# Altium schematic sheet Display_port.SchDoc
size B; Organization: Altium Limited; Address1: L3, 12a Rodborough Rd; Address2: Frenchs Forest; Address3: NSW; Address4: Australia 2086
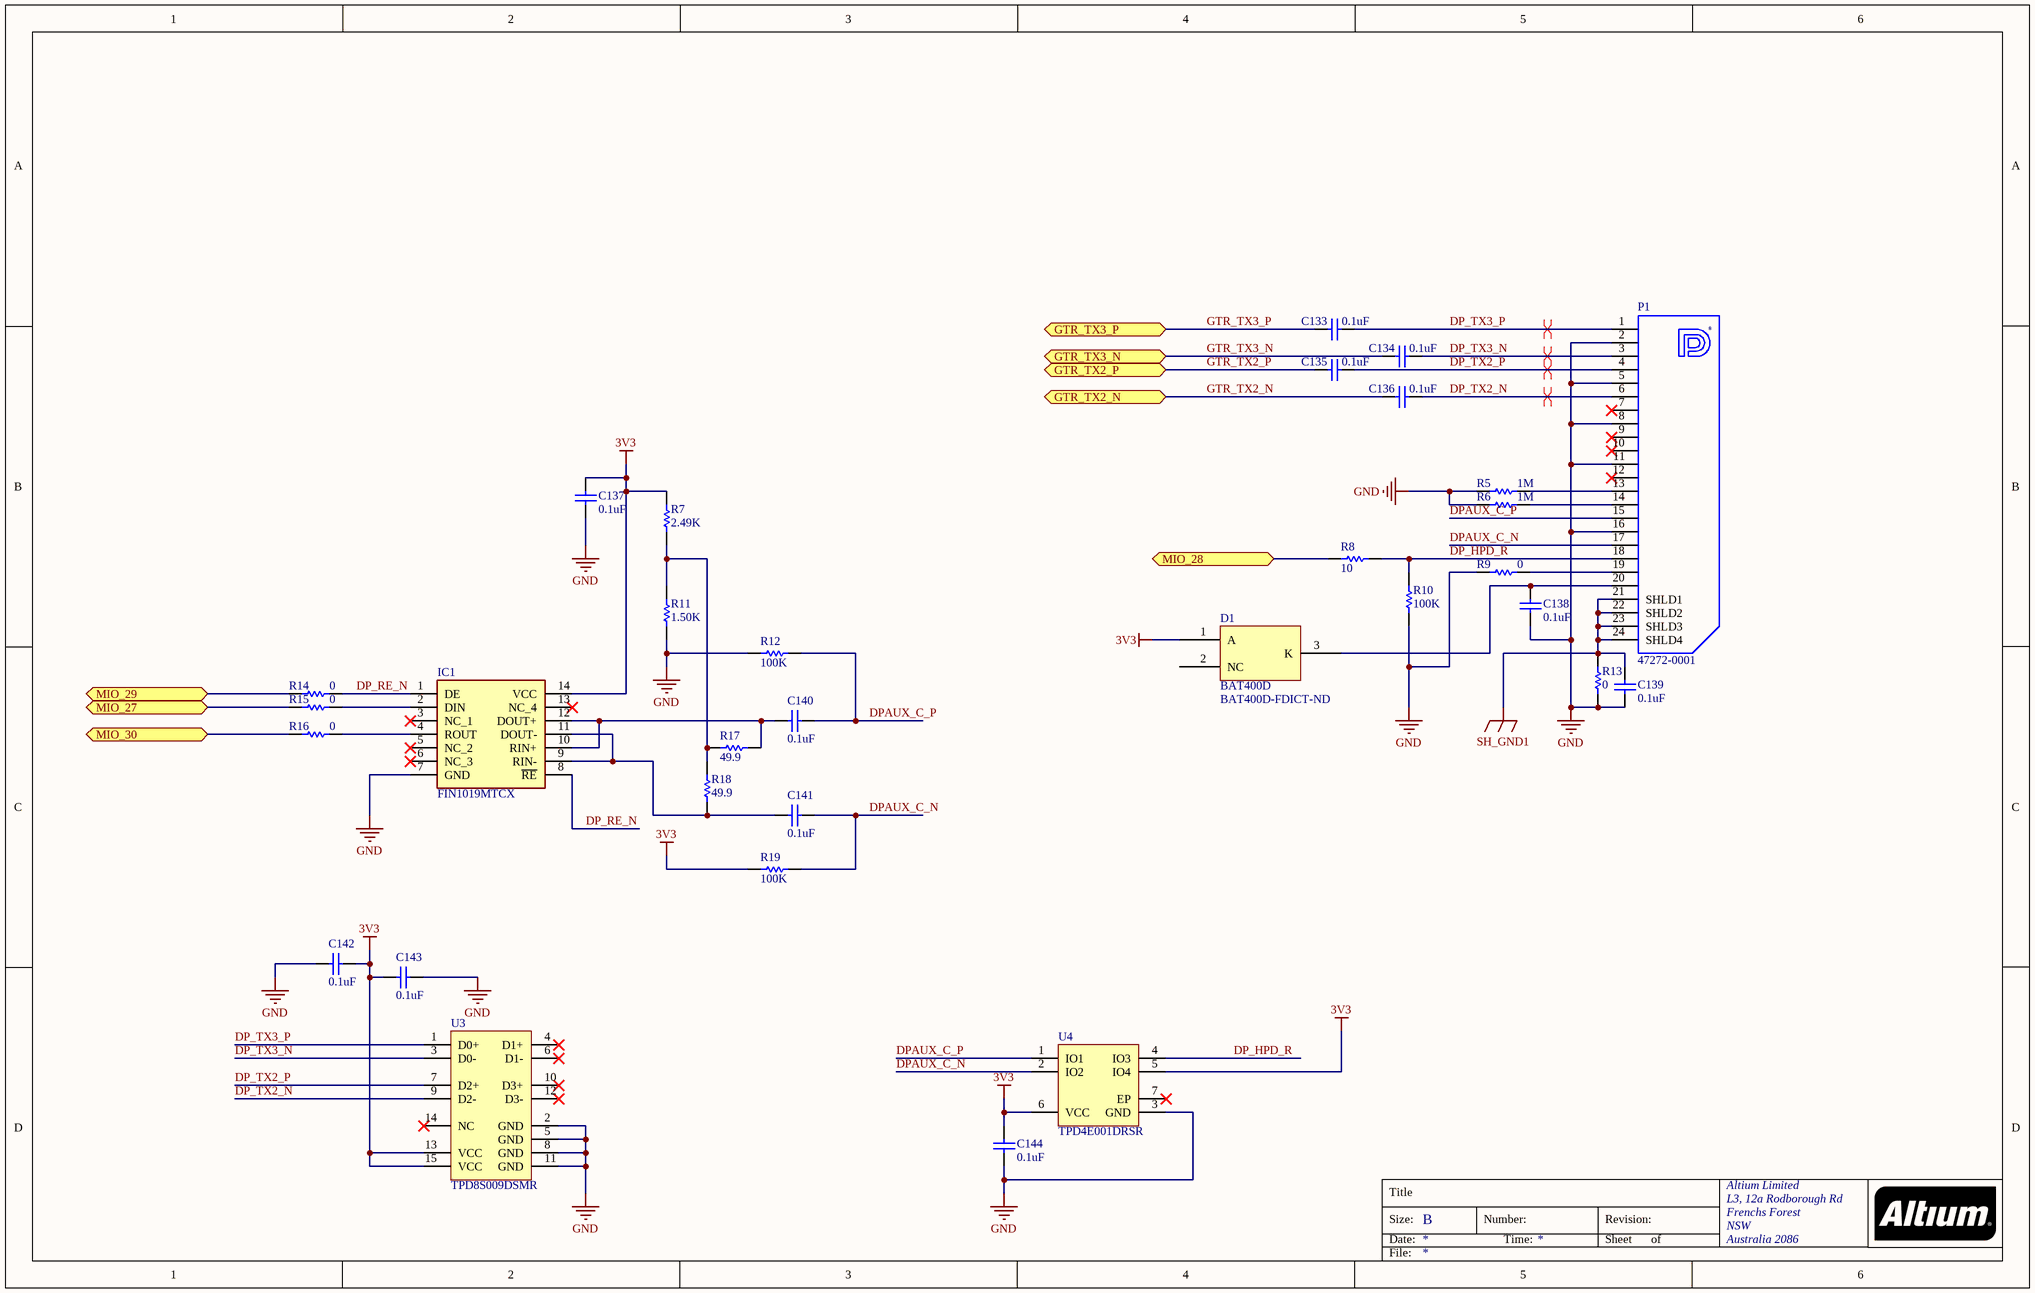
[diagram p0: Display_port.SchDoc]

## Parts
C133  0.1uF  [CAPC0201(0603)33_N]
C134  0.1uF  [CAPC0201(0603)33_N]
C135  0.1uF  [CAPC0201(0603)33_N]
C136  0.1uF  [CAPC0201(0603)33_N]
C137  0.1uF  [CAPC0201(0603)33_N]
C138  0.1uF  [CAPC0201(0603)33_N]
C139  0.1uF  [CAPC0201(0603)33_N]
C140  0.1uF  [CAPC0201(0603)33_N]
C141  0.1uF  [CAPC0201(0603)33_N]
C142  0.1uF  [CAPC0201(0603)33_N]
C143  0.1uF  [CAPC0201(0603)33_N]
C144  0.1uF  [CAPC0201(0603)33_N]
D1  BAT400D  Supplier Part Number 1: BAT400D-FDICT-ND  [SOT95P236X110-3N]
IC1  FIN1019MTCX  [SOP65P640X120-14N]
P1  47272-0001  [MOLX-47272-0001_V]
R5  1M  [RESC0402(1005)_N]
R6  1M  [RESC0402(1005)_N]
R7  2.49K  [RESC0402(1005)_N]
R8  10  [RESC0402(1005)_N]
R9  0  [RESC0402(1005)_N]
R10  100K  [RESC0402(1005)_N]
R11  1.50K  [RESC0402(1005)_N]
R12  100K  [RESC0402(1005)_N]
R13  0  [RESC0402(1005)_N]
R14  0  [RESC0402(1005)_N]
R15  0  [RESC0402(1005)_N]
R16  0  [RESC0402(1005)_N]
R17  49.9  [RESC0402(1005)_N]
R18  49.9  [RESC0402(1005)_N]
R19  100K  [RESC0402(1005)_N]
U3  TPD8S009DSMR  [DSM0015A_V]
U4  TPD4E001DRSR  [DRS0006A_V]

## Ports
GTR_TX2_N (bidir), GTR_TX2_P (bidir), GTR_TX3_N (bidir), GTR_TX3_P (bidir), MIO_27 (bidir), MIO_28 (bidir), MIO_29 (bidir), MIO_30 (bidir)

## Nets
3V3: C137.2 C142.1 C143.2 C144.2 D1.1(A) IC1.14(VCC) R7.2 R19.2 U3.13(VCC) U3.15(VCC) U4.5(IO4) U4.6(VCC)
GND: C137.1 C138.1 C139.1 C142.2 C143.1 C144.1 IC1.7(GND) P1.2 P1.5 P1.8 P1.11 P1.16 R5.1 R6.1 R9.1 R10.1 R11.1 R12.2 R13.2 U3.2(GND) U3.5(GND) U3.8(GND) U3.11(GND) U4.3(GND)
SH_GND1: C139.2 P1.21(SHLD1) P1.22(SHLD2) P1.23(SHLD3) P1.24(SHLD4) R13.1
DP_HPD_R: P1.18 R8.2 R10.2 U4.4(IO3)
DP_RE_N: IC1.1(DE) IC1.8(~{RE}) R14.1
DP_TX2_N: C136.2 P1.6 U3.9(D2-)
DP_TX2_P: C135.2 P1.4 U3.7(D2+)
DP_TX3_N: C134.2 P1.3 U3.3(D0-)
DP_TX3_P: C133.2 P1.1 U3.1(D0+)
DPAUX_C_N: C141.2 P1.17 R19.1 U4.2(IO2)
DPAUX_C_P: C140.2 P1.15 R12.1 U4.1(IO1)
GTR_TX2_N: C136.1 ; port GTR_TX2_N
GTR_TX2_P: C135.1 ; port GTR_TX2_P
GTR_TX3_N: C134.1 ; port GTR_TX3_N
GTR_TX3_P: C133.1 ; port GTR_TX3_P
MIO_27: R15.2 ; port MIO_27
MIO_28: R8.1 ; port MIO_28
MIO_29: R14.2 ; port MIO_29
MIO_30: R16.2 ; port MIO_30
NetC138_2: C138.2 D1.3(K) P1.20
NetC140_1: C140.1 IC1.10(RIN+) IC1.12(DOUT+) R17.1
NetC141_1: C141.1 IC1.9(RIN-) IC1.11(DOUT-) R18.2
NetIC1_2: IC1.2(DIN) R15.1
NetIC1_4: IC1.4(ROUT) R16.1
NetP1_13: P1.13 R5.2
NetP1_14: P1.14 R6.2
NetP1_19: P1.19 R9.2
NetR7_1: R7.1 R11.2 R17.2 R18.1

Not connected (* = marked no-connect by the designer): D1 2(NC); IC1 3(NC_1)* 5(NC_2)* 6(NC_3)* 13(NC_4)*; P1 7* 9* 10* 12*; U3 4(D1+)* 6(D1-)* 10(D3+)* 12(D3-)* 14(NC)*; U4 7(EP)*

## Layout directives
differential pair: DP_TX2_N, DP_TX2_P, DP_TX3_N, DP_TX3_P

## Notes on the sheet
- Title
- Size:
- Date:
- B
- Number:
- Time:
- Revision:
- Sheet
- of
- File:
- (in symbol CMP-2000-05608-1) ®

## Library data of the parts
C133-C144 = CAP_0201
IC1 = FIN1019MTCX: Integrated Circuit; Manufacturer_Name: Fairchild Semiconductor; Datasheet Link: http://media.digikey.com/pdf/Data%20Sheets/Fairchild%20PDFs/FIN1019.pdf; Height: 1.2mm; Manufacturer_Part_Number: FIN1019MTCX; Mouser Part Number: 512-FIN1019MTCX; Mouser Price/Stock: https://www.mouser.com/Search/Refine.aspx?Keyword=512-FIN1019MTCX; RS Part Number: 8070805P; RS Price/Stock: http://uk.rs-online.com/web/p/products/8070805P
P1 = CMP-2000-05608-1: DisplayPort Connector, Pitch 0.5 mm, 1 x 20 Position, Height 6.65 mm, -20 to 85 degC, RoHS, Tape and Reel; Manufacturer: Molex; No. of Mating Cycles: 10000; Contact Resistance Max: 50mohm; Connector Mounting: PCB; Mating Force: 44.1N; Withstand Voltage: 500V; Voltage Rating V AC: 40V; Insulation Resistance: 10Mohm; Current Max: 0.5A; Gender: Receptacle; Contact Termination: SurfaceMountRightAngle; Mounting Orientation: Horizontal; De-mating Force: 9.8N; Contact Resistance: 30mohm; Pitch Spacing: 0.50mm; No. of Contacts: 20; Manufacturer URL: http://www.molex.com/; Datasheet Version: Rev. F, 06/2009; Package Description: DisplayPort Connector, Pitch 0.5 mm, 1 x 20 Position, Height 6.65 mm; Connector Type: DisplayPort; Package Reference: 47272-0001; Lead Spacing: 0.5mm; Datasheet URL: http://www.molex.com/pdm_docs/sd/472720001_sd.pdf; Operating Temperature Max: +85°C; Series: 47272; Flammability Rating: UL94V-0; Contact Plating: Gold; Operating Temperature Min: -20°C; Mounting Technology: SurfaceMount; Contact Material: CopperAlloy
R5-R19 = RES_0402
U3 = CMP-0326-00039-2: ESD Solution for HDMI / DisplayPort, 8 Channels, -40 to +85 degC, 15-pin SON (DSM); Manufacturer: Texas Instruments; Eco-Plan: TBD; IEC 61000-4-2 Air-Gap(+/- kV): 9; IO Capacitance(Typ)(pF): 0.8; IO Leakage Current(nA): 10; IEC 61000-4-2 Contact(+/- kV): 8; Differential Capacitance(pF): 0.05; ComponentLink1Description: Manufacturer URL; ComponentLink2URL: http://www.ti.com/general/docs/lit/getliterature.tsp?genericPartNumber=TPD8S009&fileType=pdf; PackageDescription: 15-Pin Plastic Small Outline Flat No-Lead, 2.5 x 6.5 x 0.8 mm Body, 0.5/1.5 mm Pitch; PackageReference: DSM0015A; ComponentLink2Description: Datasheet; PackageVersion: revA, Aug-2007; DatasheetVersion: SLVS816; SubFamily: ESD Solution; Breakdown Voltage(Min)(V): 9; Mounting Technology: Surface Mount; ComponentLink1URL: http://www.ti.com/; PartNumber: TPD8S009DSMR; ComponentLink3URL: SamplesURL:http://www.ti.com/product/tpd8s009#samples; ComponentLink3Description: URL Link1
U4 = CMP-0326-00041-3: Low-Capacitance + / - 15-kV ESD Protection Array for High-Speed Data Interfaces, 4 Channels, -40 to +85 degC, 6-pin SON (DRS), Green (RoHS & no Sb/Br); Manufacturer: Texas Instruments; IO Capacitance(Typ)(pF): 1.5; Breakdown Voltage(Min)(V): 11; Serial ATA / eSATA: TRUE; IEC 61000-4-2 Air-Gap(+/- kV): 15; SubFamily: ESD Solution; IEC 61000-4-2 Contact(+/- kV): 8; ComponentLink1URL: http://www.ti.com/; Eco-Plan: Green (RoHS & no Sb/Br); ComponentLink1Description: Manufacturer URL; PartNumber: TPD4E001DRSR; ComponentLink3Description: URL Link1; Mounting Technology: Surface Mount; PackageDescription: 6-Pin Plastic Small Outline No-Lead, 3 x 3 x 0.8 mm Body, 0.95 mm Pitch; ComponentLink3URL: SamplesURL:http://www.ti.com/product/tpd4e001#samples; 1394 / Firewire: TRUE; PackageVersion: revF, Jul-2011; PackageReference: DRS0006A; USB High Speed: TRUE; ComponentLink2Description: Datasheet; IO Leakage Current(nA): 1.5; ComponentLink2URL: http://www.ti.com/general/docs/lit/getliterature.tsp?genericPartNumber=TPD4E001&fileType=pdf; DatasheetVersion: SLLS682G
D1 = BAT400D: Supplier 1: Digi-Key